# Altium schematic sheet 02-8 Motors.SchDoc: 8 Motors
size A3; Date: 2024-8-22; SheetNumber: 02; SheetTotal: 03
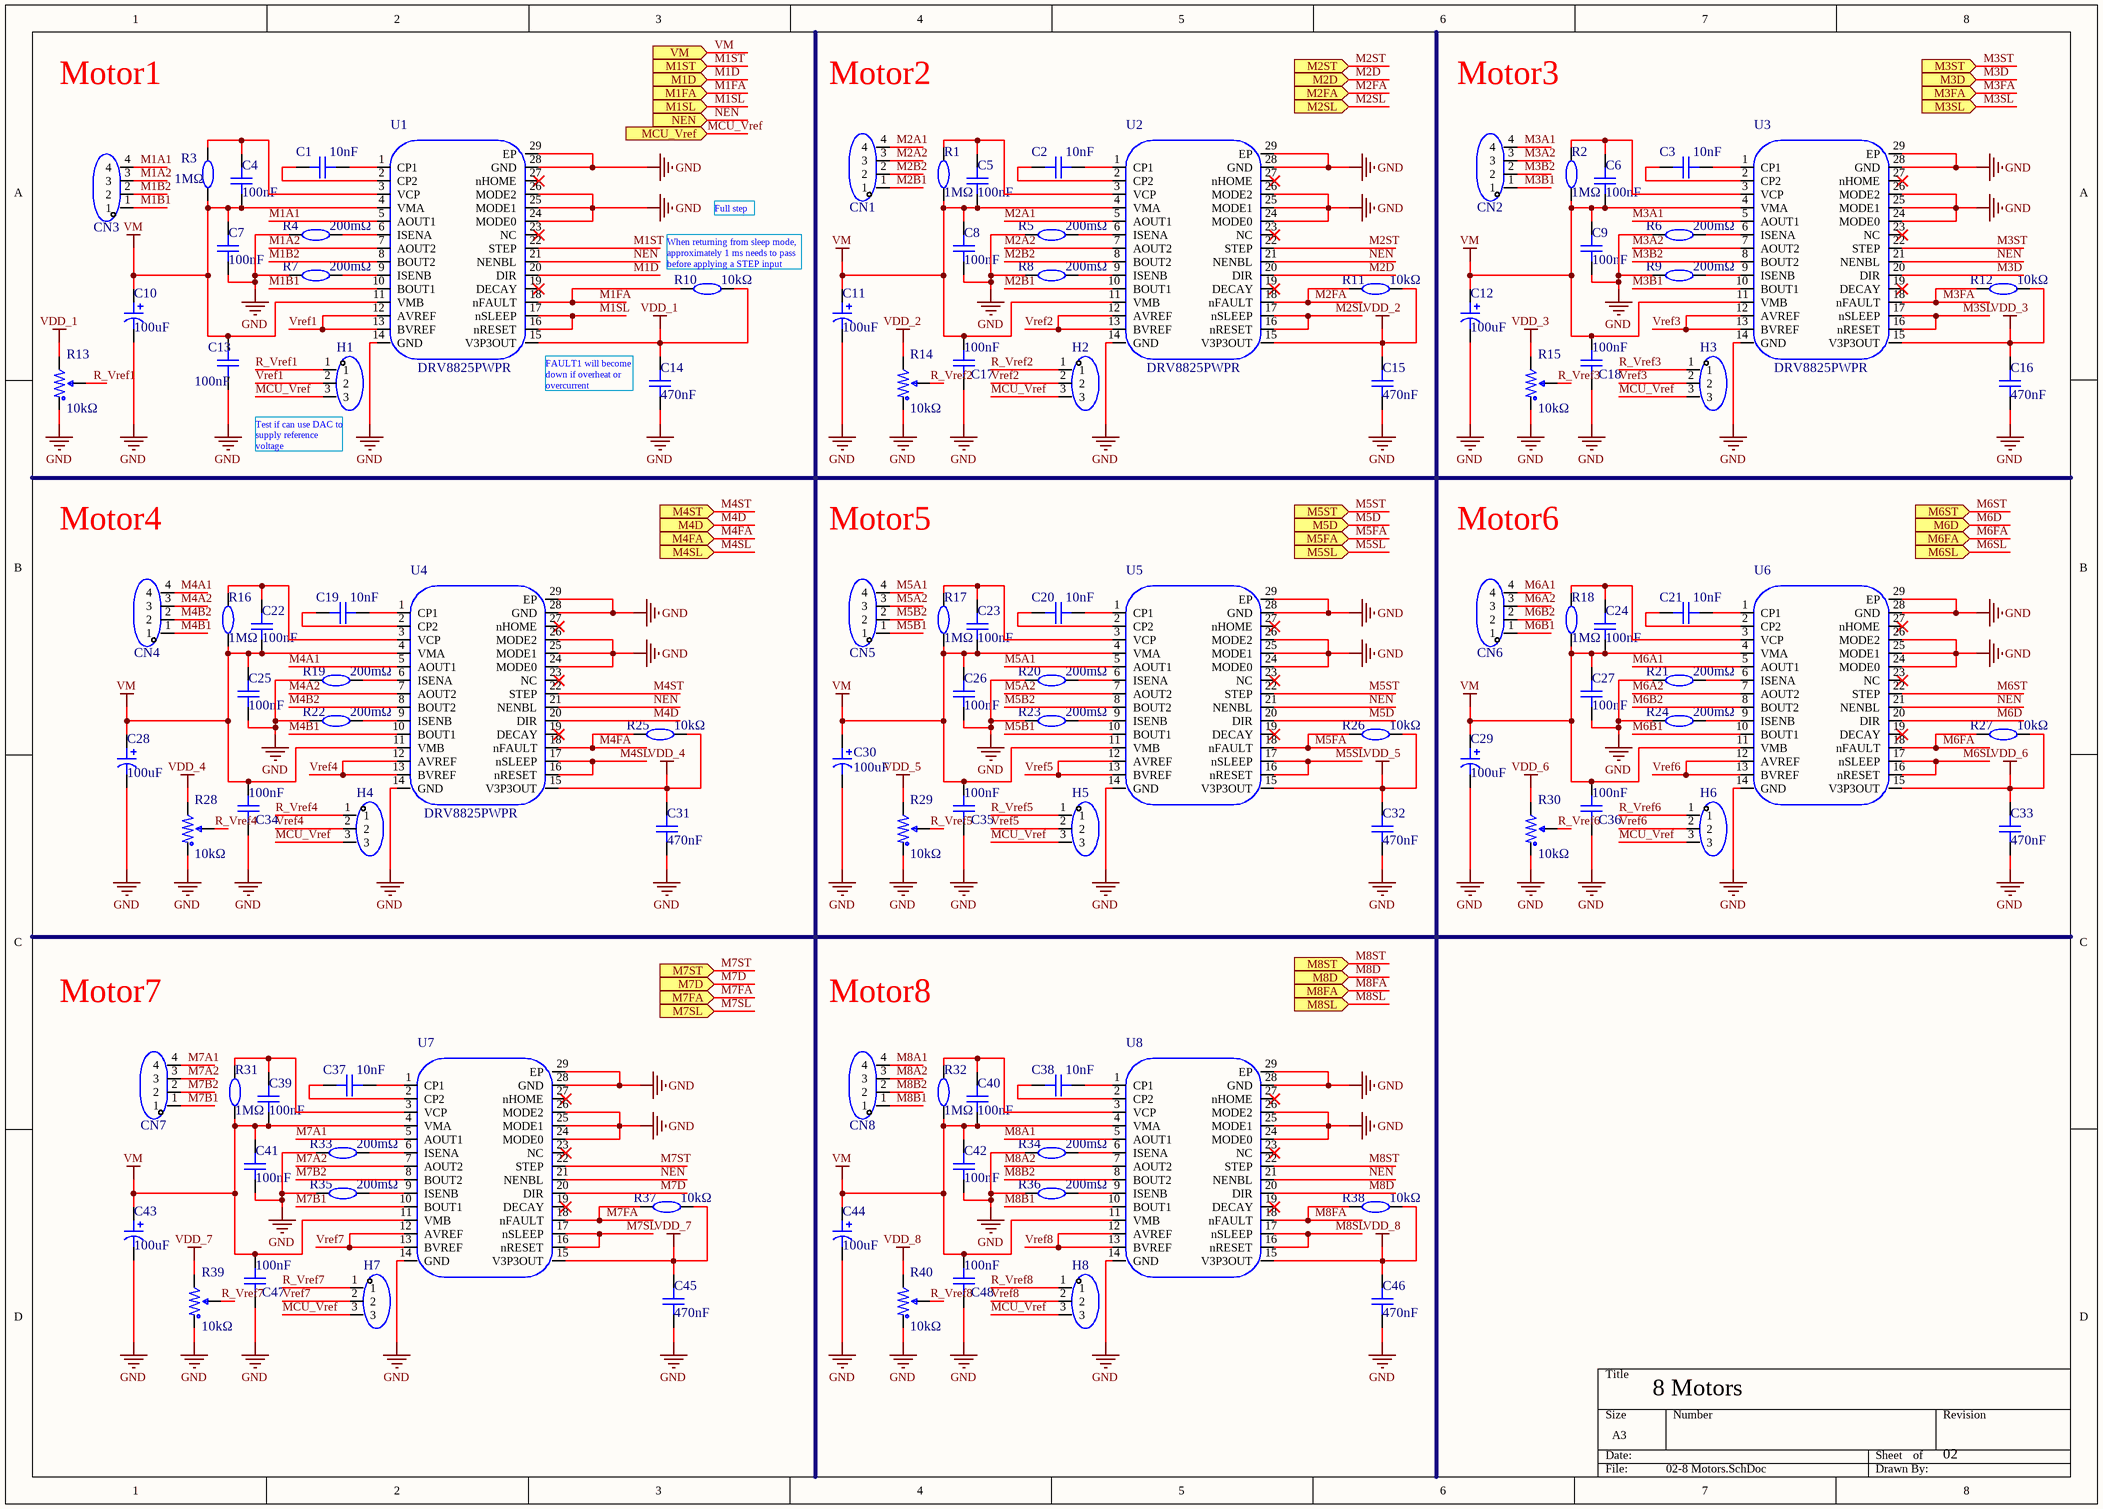
[diagram p0: 02-8 Motors.SchDoc]

## Parts
C1  10nF  [C0603]
C2  10nF  [C0603]
C3  10nF  [C0603]
C4  100nF  [C0603]
C5  100nF  [C0603]
C6  100nF  [C0603]
C7  100nF  [C0603]
C8  100nF  [C0603]
C9  100nF  [C0603]
C10  100uF  [SMD6.3_7.7_100uF]
C11  100uF  [SMD6.3_7.7_100uF]
C12  100uF  [SMD6.3_7.7_100uF]
C13  100nF  [C0603]
C14  470nF  [C0603]
C15  470nF  [C0603]
C16  470nF  [C0603]
C17  100nF  [C0603]
C18  100nF  [C0603]
C19  10nF  [C0603]
C20  10nF  [C0603]
C21  10nF  [C0603]
C22  100nF  [C0603]
C23  100nF  [C0603]
C24  100nF  [C0603]
C25  100nF  [C0603]
C26  100nF  [C0603]
C27  100nF  [C0603]
C28  100uF  [SMD6.3_7.7_100uF]
C29  100uF  [SMD6.3_7.7_100uF]
C30  100uF  [SMD6.3_7.7_100uF]
C31  470nF  [C0603]
C32  470nF  [C0603]
C33  470nF  [C0603]
C34  100nF  [C0603]
C35  100nF  [C0603]
C36  100nF  [C0603]
C37  10nF  [C0603]
C38  10nF  [C0603]
C39  100nF  [C0603]
C40  100nF  [C0603]
C41  100nF  [C0603]
C42  100nF  [C0603]
C43  100uF  [SMD6.3_7.7_100uF]
C44  100uF  [SMD6.3_7.7_100uF]
C45  470nF  [C0603]
C46  470nF  [C0603]
C47  100nF  [C0603]
C48  100nF  [C0603]
CN1  ZX-XH2.54-4PZZ  [ZX-XH2.54-4PZZ]  (value not drawn)
CN2  ZX-XH2.54-4PZZ  [ZX-XH2.54-4PZZ]  (value not drawn)
CN3  ZX-XH2.54-4PZZ  [ZX-XH2.54-4PZZ]  (value not drawn)
CN4  ZX-XH2.54-4PZZ  [ZX-XH2.54-4PZZ]  (value not drawn)
CN5  ZX-XH2.54-4PZZ  [ZX-XH2.54-4PZZ]  (value not drawn)
CN6  ZX-XH2.54-4PZZ  [ZX-XH2.54-4PZZ]  (value not drawn)
CN7  ZX-XH2.54-4PZZ  [ZX-XH2.54-4PZZ]  (value not drawn)
CN8  ZX-XH2.54-4PZZ  [ZX-XH2.54-4PZZ]  (value not drawn)
H1  PZ254V-11-03P  [HC-1.25-3PLT]  (value not drawn)
H2  PZ254V-11-03P  [HC-1.25-3PLT]  (value not drawn)
H3  PZ254V-11-03P  [HC-1.25-3PLT]  (value not drawn)
H4  PZ254V-11-03P  [HC-1.25-3PLT]  (value not drawn)
H5  PZ254V-11-03P  [HC-1.25-3PLT]  (value not drawn)
H6  PZ254V-11-03P  [HC-1.25-3PLT]  (value not drawn)
H7  PZ254V-11-03P  [HC-1.25-3PLT]  (value not drawn)
H8  PZ254V-11-03P  [HC-1.25-3PLT]  (value not drawn)
R1  1MΩ  [R0603]
R2  1MΩ  [R0603]
R3  1MΩ  [R0603]
R4  200mΩ  [R1206_200mΩ]
R5  200mΩ  [R1206_200mΩ]
R6  200mΩ  [R1206_200mΩ]
R7  200mΩ  [R1206_200mΩ]
R8  200mΩ  [R1206_200mΩ]
R9  200mΩ  [R1206_200mΩ]
R10  10kΩ  [R0603_10KΩ]
R11  10kΩ  [R0603_10KΩ]
R12  10kΩ  [R0603_10KΩ]
R13  10kΩ  [R10k_KT]
R14  10kΩ  [R10k_KT]
R15  10kΩ  [R10k_KT]
R16  1MΩ  [R0603]
R17  1MΩ  [R0603]
R18  1MΩ  [R0603]
R19  200mΩ  [R1206_200mΩ]
R20  200mΩ  [R1206_200mΩ]
R21  200mΩ  [R1206_200mΩ]
R22  200mΩ  [R1206_200mΩ]
R23  200mΩ  [R1206_200mΩ]
R24  200mΩ  [R1206_200mΩ]
R25  10kΩ  [R0603_10KΩ]
R26  10kΩ  [R0603_10KΩ]
R27  10kΩ  [R0603_10KΩ]
R28  10kΩ  [R10k_KT]
R29  10kΩ  [R10k_KT]
R30  10kΩ  [R10k_KT]
R31  1MΩ  [R0603]
R32  1MΩ  [R0603]
R33  200mΩ  [R1206_200mΩ]
R34  200mΩ  [R1206_200mΩ]
R35  200mΩ  [R1206_200mΩ]
R36  200mΩ  [R1206_200mΩ]
R37  10kΩ  [R0603_10KΩ]
R38  10kΩ  [R0603_10KΩ]
R39  10kΩ  [R10k_KT]
R40  10kΩ  [R10k_KT]
U1  DRV8825PWPR  [DRV8825PWPR]
U2  DRV8825PWPR  [DRV8825PWPR]
U3  DRV8825PWPR  [DRV8825PWPR]
U4  DRV8825PWPR  [DRV8825PWPR]
U5  DRV8825PWPR  [DRV8825PWPR]  (value not drawn)
U6  DRV8825PWPR  [DRV8825PWPR]  (value not drawn)
U7  DRV8825PWPR  [DRV8825PWPR]  (value not drawn)
U8  DRV8825PWPR  [DRV8825PWPR]  (value not drawn)

## Ports
M1D (in), M1FA (in), M1SL (in), M1ST (in), M2D (in), M2FA (in), M2SL (in), M2ST (in), M3D (in), M3FA (in), M3SL (in), M3ST (in), M4D (in), M4FA (in), M4SL (in), M4ST (in), M5D (in), M5FA (in), M5SL (in), M5ST (in), M6D (in), M6FA (in), M6SL (in), M6ST (in), M7D (in), M7FA (in), M7SL (in), M7ST (in), M8D (in), M8FA (in), M8SL (in), M8ST (in), MCU_Vref (in), NEN (in), VM (in)

## Nets
GND: C7.1 C8.1 C9.1 C10.2 C11.2 C12.2 C13.1 C14.1 C15.1 C16.1 C17.1 C18.1 C25.1 C26.1 C27.1 C28.2 C29.2 C30.2 C31.1 C32.1 C33.1 C34.1 C35.1 C36.1 C41.1 C42.1 C43.2 C44.2 C45.1 C46.1 C47.1 C48.1 R4.1 R5.1 R6.1 R7.1 R8.1 R9.1 R13.1 R14.1 R15.1 R19.1 R20.1 R21.1 R22.1 R23.1 R24.1 R28.1 R29.1 R30.1 R33.1 R34.1 R35.1 R36.1 R39.1 R40.1 U1.14(GND) U1.24(MODE0) U1.25(MODE1) U1.26(MODE2) U1.28(GND) U1.29(EP) U2.14(GND) U2.24(MODE0) U2.25(MODE1) U2.26(MODE2) U2.28(GND) U2.29(EP) U3.14(GND) U3.24(MODE0) U3.25(MODE1) U3.26(MODE2) U3.28(GND) U3.29(EP) U4.14(GND) U4.24(MODE0) U4.25(MODE1) U4.26(MODE2) U4.28(GND) U4.29(EP) U5.14(GND) U5.24(MODE0) U5.25(MODE1) U5.26(MODE2) U5.28(GND) U5.29(EP) U6.14(GND) U6.24(MODE0) U6.25(MODE1) U6.26(MODE2) U6.28(GND) U6.29(EP) U7.14(GND) U7.24(MODE0) U7.25(MODE1) U7.26(MODE2) U7.28(GND) U7.29(EP) U8.14(GND) U8.24(MODE0) U8.25(MODE1) U8.26(MODE2) U8.28(GND) U8.29(EP)
VDD_1: C14.2 R10.2 R13.3 U1.15(V3P3OUT)
VDD_2: C15.2 R11.2 R14.3 U2.15(V3P3OUT)
VDD_3: C16.2 R12.2 R15.3 U3.15(V3P3OUT)
VDD_4: C31.2 R25.2 R28.3 U4.15(V3P3OUT)
VDD_5: C32.2 R26.2 R29.3 U5.15(V3P3OUT)
VDD_6: C33.2 R27.2 R30.3 U6.15(V3P3OUT)
VDD_7: C45.2 R37.2 R39.3 U7.15(V3P3OUT)
VDD_8: C46.2 R38.2 R40.3 U8.15(V3P3OUT)
VM: C4.2 C5.2 C6.2 C7.2 C8.2 C9.2 C10.1 C11.1 C12.1 C13.2 C17.2 C18.2 C22.2 C23.2 C24.2 C25.2 C26.2 C27.2 C28.1 C29.1 C30.1 C34.2 C35.2 C36.2 C39.2 C40.2 C41.2 C42.2 C43.1 C44.1 C47.2 C48.2 R1.1 R2.1 R3.1 R16.1 R17.1 R18.1 R31.1 R32.1 U1.4(VMA) U1.11(VMB) U2.4(VMA) U2.11(VMB) U3.4(VMA) U3.11(VMB) U4.4(VMA) U4.11(VMB) U5.4(VMA) U5.11(VMB) U6.4(VMA) U6.11(VMB) U7.4(VMA) U7.11(VMB) U8.4(VMA) U8.11(VMB) ; port VM
M1A1: CN3.4 U1.5(AOUT1)
M1A2: CN3.3 U1.7(AOUT2)
M1B1: CN3.1 U1.10(BOUT1)
M1B2: CN3.2 U1.8(BOUT2)
M1D: U1.20(DIR) ; port M1D
M1FA: R10.1 U1.18(nFAULT) ; port M1FA
M1SL: U1.16(nRESET) U1.17(nSLEEP) ; port M1SL
M1ST: U1.22(STEP) ; port M1ST
M2A1: CN1.4 U2.5(AOUT1)
M2A2: CN1.3 U2.7(AOUT2)
M2B1: CN1.1 U2.10(BOUT1)
M2B2: CN1.2 U2.8(BOUT2)
M2D: U2.20(DIR) ; port M2D
M2FA: R11.1 U2.18(nFAULT) ; port M2FA
M2SL: U2.16(nRESET) U2.17(nSLEEP) ; port M2SL
M2ST: U2.22(STEP) ; port M2ST
M3A1: CN2.4 U3.5(AOUT1)
M3A2: CN2.3 U3.7(AOUT2)
M3B1: CN2.1 U3.10(BOUT1)
M3B2: CN2.2 U3.8(BOUT2)
M3D: U3.20(DIR) ; port M3D
M3FA: R12.1 U3.18(nFAULT) ; port M3FA
M3SL: U3.16(nRESET) U3.17(nSLEEP) ; port M3SL
M3ST: U3.22(STEP) ; port M3ST
M4A1: CN4.4 U4.5(AOUT1)
M4A2: CN4.3 U4.7(AOUT2)
M4B1: CN4.1 U4.10(BOUT1)
M4B2: CN4.2 U4.8(BOUT2)
M4D: U4.20(DIR) ; port M4D
M4FA: R25.1 U4.18(nFAULT) ; port M4FA
M4SL: U4.16(nRESET) U4.17(nSLEEP) ; port M4SL
M4ST: U4.22(STEP) ; port M4ST
M5A1: CN5.4 U5.5(AOUT1)
M5A2: CN5.3 U5.7(AOUT2)
M5B1: CN5.1 U5.10(BOUT1)
M5B2: CN5.2 U5.8(BOUT2)
M5D: U5.20(DIR) ; port M5D
M5FA: R26.1 U5.18(nFAULT) ; port M5FA
M5SL: U5.16(nRESET) U5.17(nSLEEP) ; port M5SL
M5ST: U5.22(STEP) ; port M5ST
M6A1: CN6.4 U6.5(AOUT1)
M6A2: CN6.3 U6.7(AOUT2)
M6B1: CN6.1 U6.10(BOUT1)
M6B2: CN6.2 U6.8(BOUT2)
M6D: U6.20(DIR) ; port M6D
M6FA: R27.1 U6.18(nFAULT) ; port M6FA
M6SL: U6.16(nRESET) U6.17(nSLEEP) ; port M6SL
M6ST: U6.22(STEP) ; port M6ST
M7A1: CN7.4 U7.5(AOUT1)
M7A2: CN7.3 U7.7(AOUT2)
M7B1: CN7.1 U7.10(BOUT1)
M7B2: CN7.2 U7.8(BOUT2)
M7D: U7.20(DIR) ; port M7D
M7FA: R37.1 U7.18(nFAULT) ; port M7FA
M7SL: U7.16(nRESET) U7.17(nSLEEP) ; port M7SL
M7ST: U7.22(STEP) ; port M7ST
M8A1: CN8.4 U8.5(AOUT1)
M8A2: CN8.3 U8.7(AOUT2)
M8B1: CN8.1 U8.10(BOUT1)
M8B2: CN8.2 U8.8(BOUT2)
M8D: U8.20(DIR) ; port M8D
M8FA: R38.1 U8.18(nFAULT) ; port M8FA
M8SL: U8.16(nRESET) U8.17(nSLEEP) ; port M8SL
M8ST: U8.22(STEP) ; port M8ST
MCU_Vref: H1.3 H2.3 H3.3 H4.3 H5.3 H6.3 H7.3 H8.3 ; port MCU_Vref
NEN: U1.21(NENBL) U2.21(NENBL) U3.21(NENBL) U4.21(NENBL) U5.21(NENBL) U6.21(NENBL) U7.21(NENBL) U8.21(NENBL) ; port NEN
R_Vref1: H1.1 R13.2
R_Vref2: H2.1 R14.2
R_Vref3: H3.1 R15.2
R_Vref4: H4.1 R28.2
R_Vref5: H5.1 R29.2
R_Vref6: H6.1 R30.2
R_Vref7: H7.1 R39.2
R_Vref8: H8.1 R40.2
Vref1: H1.2 U1.12(AVREF) U1.13(BVREF)
Vref2: H2.2 U2.12(AVREF) U2.13(BVREF)
Vref3: H3.2 U3.12(AVREF) U3.13(BVREF)
Vref4: H4.2 U4.12(AVREF) U4.13(BVREF)
Vref5: H5.2 U5.12(AVREF) U5.13(BVREF)
Vref6: H6.2 U6.12(AVREF) U6.13(BVREF)
Vref7: H7.2 U7.12(AVREF) U7.13(BVREF)
Vref8: H8.2 U8.12(AVREF) U8.13(BVREF)
NetC1_1: C1.1 U1.2(CP2)
NetC1_2: C1.2 U1.1(CP1)
NetC2_1: C2.1 U2.2(CP2)
NetC2_2: C2.2 U2.1(CP1)
NetC3_1: C3.1 U3.2(CP2)
NetC3_2: C3.2 U3.1(CP1)
NetC4_1: C4.1 R3.2 U1.3(VCP)
NetC5_1: C5.1 R1.2 U2.3(VCP)
NetC6_1: C6.1 R2.2 U3.3(VCP)
NetC19_1: C19.1 U4.2(CP2)
NetC19_2: C19.2 U4.1(CP1)
NetC20_1: C20.1 U5.2(CP2)
NetC20_2: C20.2 U5.1(CP1)
NetC21_1: C21.1 U6.2(CP2)
NetC21_2: C21.2 U6.1(CP1)
NetC22_1: C22.1 R16.2 U4.3(VCP)
NetC23_1: C23.1 R17.2 U5.3(VCP)
NetC24_1: C24.1 R18.2 U6.3(VCP)
NetC37_1: C37.1 U7.2(CP2)
NetC37_2: C37.2 U7.1(CP1)
NetC38_1: C38.1 U8.2(CP2)
NetC38_2: C38.2 U8.1(CP1)
NetC39_1: C39.1 R31.2 U7.3(VCP)
NetC40_1: C40.1 R32.2 U8.3(VCP)
NetR4_2: R4.2 U1.6(ISENA)
NetR5_2: R5.2 U2.6(ISENA)
NetR6_2: R6.2 U3.6(ISENA)
NetR7_2: R7.2 U1.9(ISENB)
NetR8_2: R8.2 U2.9(ISENB)
NetR9_2: R9.2 U3.9(ISENB)
NetR19_2: R19.2 U4.6(ISENA)
NetR20_2: R20.2 U5.6(ISENA)
NetR21_2: R21.2 U6.6(ISENA)
NetR22_2: R22.2 U4.9(ISENB)
NetR23_2: R23.2 U5.9(ISENB)
NetR24_2: R24.2 U6.9(ISENB)
NetR33_2: R33.2 U7.6(ISENA)
NetR34_2: R34.2 U8.6(ISENA)
NetR35_2: R35.2 U7.9(ISENB)
NetR36_2: R36.2 U8.9(ISENB)

Not connected (* = marked no-connect by the designer): U1 19(DECAY)* 23(NC)* 27(nHOME)*; U2 19(DECAY)* 23(NC)* 27(nHOME)*; U3 19(DECAY)* 23(NC)* 27(nHOME)*; U4 19(DECAY)* 23(NC)* 27(nHOME)*; U5 19(DECAY)* 23(NC)* 27(nHOME)*; U6 19(DECAY)* 23(NC)* 27(nHOME)*; U7 19(DECAY)* 23(NC)* 27(nHOME)*; U8 19(DECAY)* 23(NC)* 27(nHOME)*

## Notes on the sheet
- Motor1
- Motor2
- Motor3
- Full step
- (near R10) When returning from sleep mode, approximately 1 ms needs to pass before applying a STEP input
- (near H1) Test if can use DAC to supply reference voltage
- FAULT1 will become down if overheat or overcurrent
- Motor4
- Motor5
- Motor6
- Motor7
- Motor8

## Library data of the parts
C1-C3 C19-C21 C37 C38 = C0603_10nF: 0603电容; Manufacturer: SAMSUNG(三星); Symbol: CC0603KRX7R9BB104; Add into BOM: yes; Tolerance: ±10%; Voltage Rated: 50V; Temperature Coefficient: X7R; Name: 10nF; Device: CC0603KRX7R9BB104; LCSC Part Name: 10nF ±10% 50V; Supplier Part: C100042; Manufacturer Part: CC0603KRX7R9BB104; Supplier Footprint: 0603; JLCPCB Part Class: Basic Part; Datasheet: https://atta.szlcsc.com/upload/public/pdf/source/20180910/C282072_33301C7F631E79921B82A8DAC6BCC5B3.pdf; Supplier: LCSC; Convert to PCB: yes; Value: 10nF
C4-C9 C13 C17 C18 C22-C27 C34-C36 C39-C42 C47 C48 = C0603_100nF: 0603电容; Manufacturer: SAMSUNG(三星); Symbol: CC0603KRX7R9BB104; Add into BOM: yes; Tolerance: ±10%; Voltage Rated: 50V; Temperature Coefficient: X7R; Name: 100nF; Device: CC0603KRX7R9BB104; LCSC Part Name: 100nF ±10% 50V; Supplier Part: C6119867; Manufacturer Part: CC0603KRX7R9BB104; Supplier Footprint: 0603; JLCPCB Part Class: Basic Part; Datasheet: https://atta.szlcsc.com/upload/public/pdf/source/20180910/C282072_33301C7F631E79921B82A8DAC6BCC5B3.pdf; Supplier: LCSC; Convert to PCB: yes; Value: 100nF
C10-C12 C28-C30 C43 C44 = SMD6.3_7.7_100uF: 贴片型铝电解电容 容值 100uF 精度 ±20% 额定电压 35V 纹波电流 87mA@120kHz; Manufacturer: KNSCHA(科尼盛); Symbol: RVT100UF35V67RV0034; Add into BOM: yes; φD: 6.3mm; L: 7.7mm; Lifetime @ Temp: 2000hrs@105℃; Device: RVT100UF35V67RV0034; LCSC Part Name: 100uF ±20% 35V; Supplier Part: C2836442; Manufacturer Part: RVT100UF35V67RV0034; Supplier Footprint: SMD,D6.3xL7.7mm; JLCPCB Part Class: Extended Part; Datasheet: https://atta.szlcsc.com/upload/public/pdf/source/20210528/C2836442_7F6389BF36F63F32D6DF3A507E8E95D6.pdf; Supplier: LCSC; Convert to PCB: yes; Value: 100uF; Tolerance: ±20%; Rated Voltage: 35V; Ripple Current: 87mA@120kHz; Equivalent Series Resistance(ESR): -; Operating Temperature: -55℃~+105℃; Comment_1: 100uF
C14-C16 C31-C33 C45 C46 = C0603_470nF: 0603电容; Manufacturer: SAMSUNG(三星); Symbol: CC0603KRX7R9BB104; Add into BOM: yes; Tolerance: ±10%; Voltage Rated: 25V; Temperature Coefficient: X7R; Name: 470nF; Device: CC0603KRX7R9BB104; LCSC Part Name: 470nF ±10% 25V; Supplier Part: C1623; Manufacturer Part: CC0603KRX7R9BB104; Supplier Footprint: 0603; JLCPCB Part Class: Basic Part; Datasheet: https://atta.szlcsc.com/upload/public/pdf/source/20180910/C282072_33301C7F631E79921B82A8DAC6BCC5B3.pdf; Supplier: LCSC; Convert to PCB: yes; Value: 470nF
CN1-CN8 = ZX-XH2.54-4PZZ: 直插插针; Manufacturer: Megastar(兆星); Add into BOM: yes; Pins Structure: 1x4P; Pitch: 2.54mm; Reference Series: XH; Number of PINs Per Row: 4; Current Rating (Max): 3A; Symbol: ZX-XH2.54-4PZZ; Device: ZX-XH2.54-4PZZ; LCSC Part Name: ZX-XH2.54-4PZZ; Supplier Part: C7429634; Manufacturer Part: ZX-XH2.54-4PZZ; Supplier Footprint: 插件,P=2.54mm; JLCPCB Part Class: Extended Part; Datasheet: https://atta.szlcsc.com/upload/public/pdf/source/20230619/B529A2163E0159A644AB3383D208FB03.pdf; Supplier: LCSC; Convert to PCB: yes; Mounting Style: 直插; Number of Pins: 4P; Number of Rows: 1; Row Spacing: -; Contact Material: 黄铜; Contact Plating: 锡; Operating Temperature Range: -25℃~+85℃; Comment_1: ZX-XH2.54-4PZZ
H1-H8 = HC-1.25-3PLT: 排针3P; Manufacturer: XFCN(兴飞); Symbol: PZ254V-11-03P_C2937625; Add into BOM: yes; Pin Structure: 1x3P; Pitch: 2.54mm; Circluar Pins/Square Pins: 方针; Current Rating (Max): 3A; Voltage Rating (Max): 250V; Device: PZ254V-11-03P; LCSC Part Name: 间距:2.54mm 1x3P 直插 方针; Supplier Part: C2937625; Manufacturer Part: PZ254V-11-03P; Supplier Footprint: 插件,P=2.54mm; JLCPCB Part Class: Extended Part; Datasheet: https://atta.szlcsc.com/upload/public/pdf/source/20200309/C492402_8335C3D49C4E4C618838D59BB1D024C1.pdf; Supplier: LCSC; Convert to PCB: yes; Row Spacing: -; Mounting Type: 直插; Number of Rows: 单排; Number of Pins: 3P; Length of Mating Pin: 6mm; Insulation Height: 2.5mm; Length of End Connection Pin: 3mm; Operating Temperature Range: -40℃~+105℃; Color: 黑色; Comment_1: PZ254V-11-03P
R1-R3 R16-R18 R31 R32 = R0603_1MΩ: 0603电阻; Manufacturer: UNI-ROYAL(厚声); Symbol: 0603WAF5100T5E; Add into BOM: yes; Tolerance: ±1%; Power(Watts): 100mW; Overload Voltage (Max): 75V; Temperature Coefficient: ±100ppm/℃; Name: 1MΩ; Device: 0603WAF5100T5E; LCSC Part Name: 1MΩ ±1% 100mW 厚膜电阻; Supplier Part: C22935; Manufacturer Part: 0603WAF5100T5E; Supplier Footprint: 0603; JLCPCB Part Class: Basic Part; Datasheet: https://atta.szlcsc.com/upload/public/pdf/source/20200306/C422600_1E6D84923E4A46A82E41ADD87F860B5C.pdf; Supplier: LCSC; Convert to PCB: yes; Type: 厚膜电阻; Value: 1MΩ; Operating Temperature Range: -55℃~+155℃
R4-R9 R19-R24 R33-R36 = R1206_200mΩ: 1206电阻; Manufacturer: UNI-ROYAL(厚声); Symbol: 1206W4F200LT5E; Add into BOM: yes; Tolerance: ±1%; Power(Watts): 250mW; Overload Voltage (Max): 200V; Temperature Coefficient: ±800ppm/℃; Device: 1206W4F200LT5E; LCSC Part Name: 200mΩ ±1% 250mW 厚膜电阻; Supplier Part: C25335; Manufacturer Part: 1206W4F200LT5E; Supplier Footprint: 1206; JLCPCB Part Class: Extended Part; Datasheet: https://atta.szlcsc.com/upload/public/pdf/source/20200306/C422600_1E6D84923E4A46A82E41ADD87F860B5C.pdf; Supplier: LCSC; Convert to PCB: yes; Type: 厚膜电阻; Value: 200mΩ; Operating Temperature Range: -55℃~+155℃; Comment_1: 200mΩ
R10-R12 R25-R27 R37 R38 = R0603_10KΩ: 0603电阻; Manufacturer: UNI-ROYAL(厚声); Symbol: 0603WAF1002T5E; Add into BOM: yes; Tolerance: ±1%; Power(Watts): 100mW; Overload Voltage (Max): 75V; Temperature Coefficient: ±100ppm/℃; Device: 0603WAF1002T5E; LCSC Part Name: 厚膜电阻 10kΩ ±1% 100mW; Supplier Part: C25804; Manufacturer Part: 0603WAF1002T5E; Supplier Footprint: 0603; JLCPCB Part Class: Basic Part; Datasheet: https://atta.szlcsc.com/upload/public/pdf/source/20200306/C422600_1E6D84923E4A46A82E41ADD87F860B5C.pdf; Supplier: LCSC; Convert to PCB: yes; Type: 厚膜电阻; Value: 10kΩ; Operating Temperature Range: -55℃~+155℃; Comment_1: 10kΩ
R13-R15 R28-R30 R39 R40 = R10k_KT: 可调电阻/电位器   阻值 10kΩ   精度 ±25%   额定电压 -   功率 150mW   温度系数 ±250ppm/℃   圈数 1; Manufacturer: BOURNS; Symbol: TC33X-2-103E; Add into BOM: yes; Turns: 1; Device: TC33X-2-103E; LCSC Part Name: 10kΩ ±25%; Supplier Part: C719176; Manufacturer Part: TC33X-2-103E; Supplier Footprint: SMD-3P,3.8x3.6mm; JLCPCB Part Class: Extended Part; Datasheet: https://atta.szlcsc.com/upload/public/pdf/source/20200810/C720646_BB66A75E654D5E1D30127FF45BCD3C26.pdf; Supplier: LCSC; Convert to PCB: yes; Value: 10kΩ; Tolerance: ±25%; Rated Voltage: -; Power(Watts): 150mW; Temperature Coefficient: ±250ppm/℃; Comment_1: 10kΩ
U1-U8 = DRV8825PWPR: 步进电机驱动芯片; Manufacturer: TI(德州仪器); Add into BOM: yes; Symbol: DRV8825PWPR; Device: DRV8825PWPR; LCSC Part Name: 2.5A 45V电机驱动芯片; Supplier Part: C81582; Manufacturer Part: DRV8825PWPR; Supplier Footprint: HTSSOP-28-EP; JLCPCB Part Class: Extended Part; Datasheet: https://www.ti.com/cn/lit/gpn/drv8825; Supplier: LCSC; Convert to PCB: yes; Comment_1: DRV8825PWPR